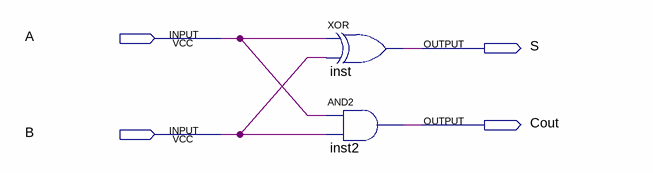
[diagram p0: schematic sheet]
// Quartus schematic half_adder_1b.bdf as structural Verilog: 2 symbols, 4 pins
module half_adder_1b (
  input  A,
  input  B,
  output S,
  output Cout
);

  xor inst (S, A, B);
  and inst2 (Cout, A, B);
endmodule
